# EasyEDA Pro project 毕设.eprj, schematic Schematic3
Board Name: 电源板毕设; Create Date: 2025-04-14; Page Name: P1; Project Name: 毕设; Schematic Name: Schematic3; Update Date: 2025-04-14; Company: 嘉立创EDA; Page Size: A4; Version: V1.0
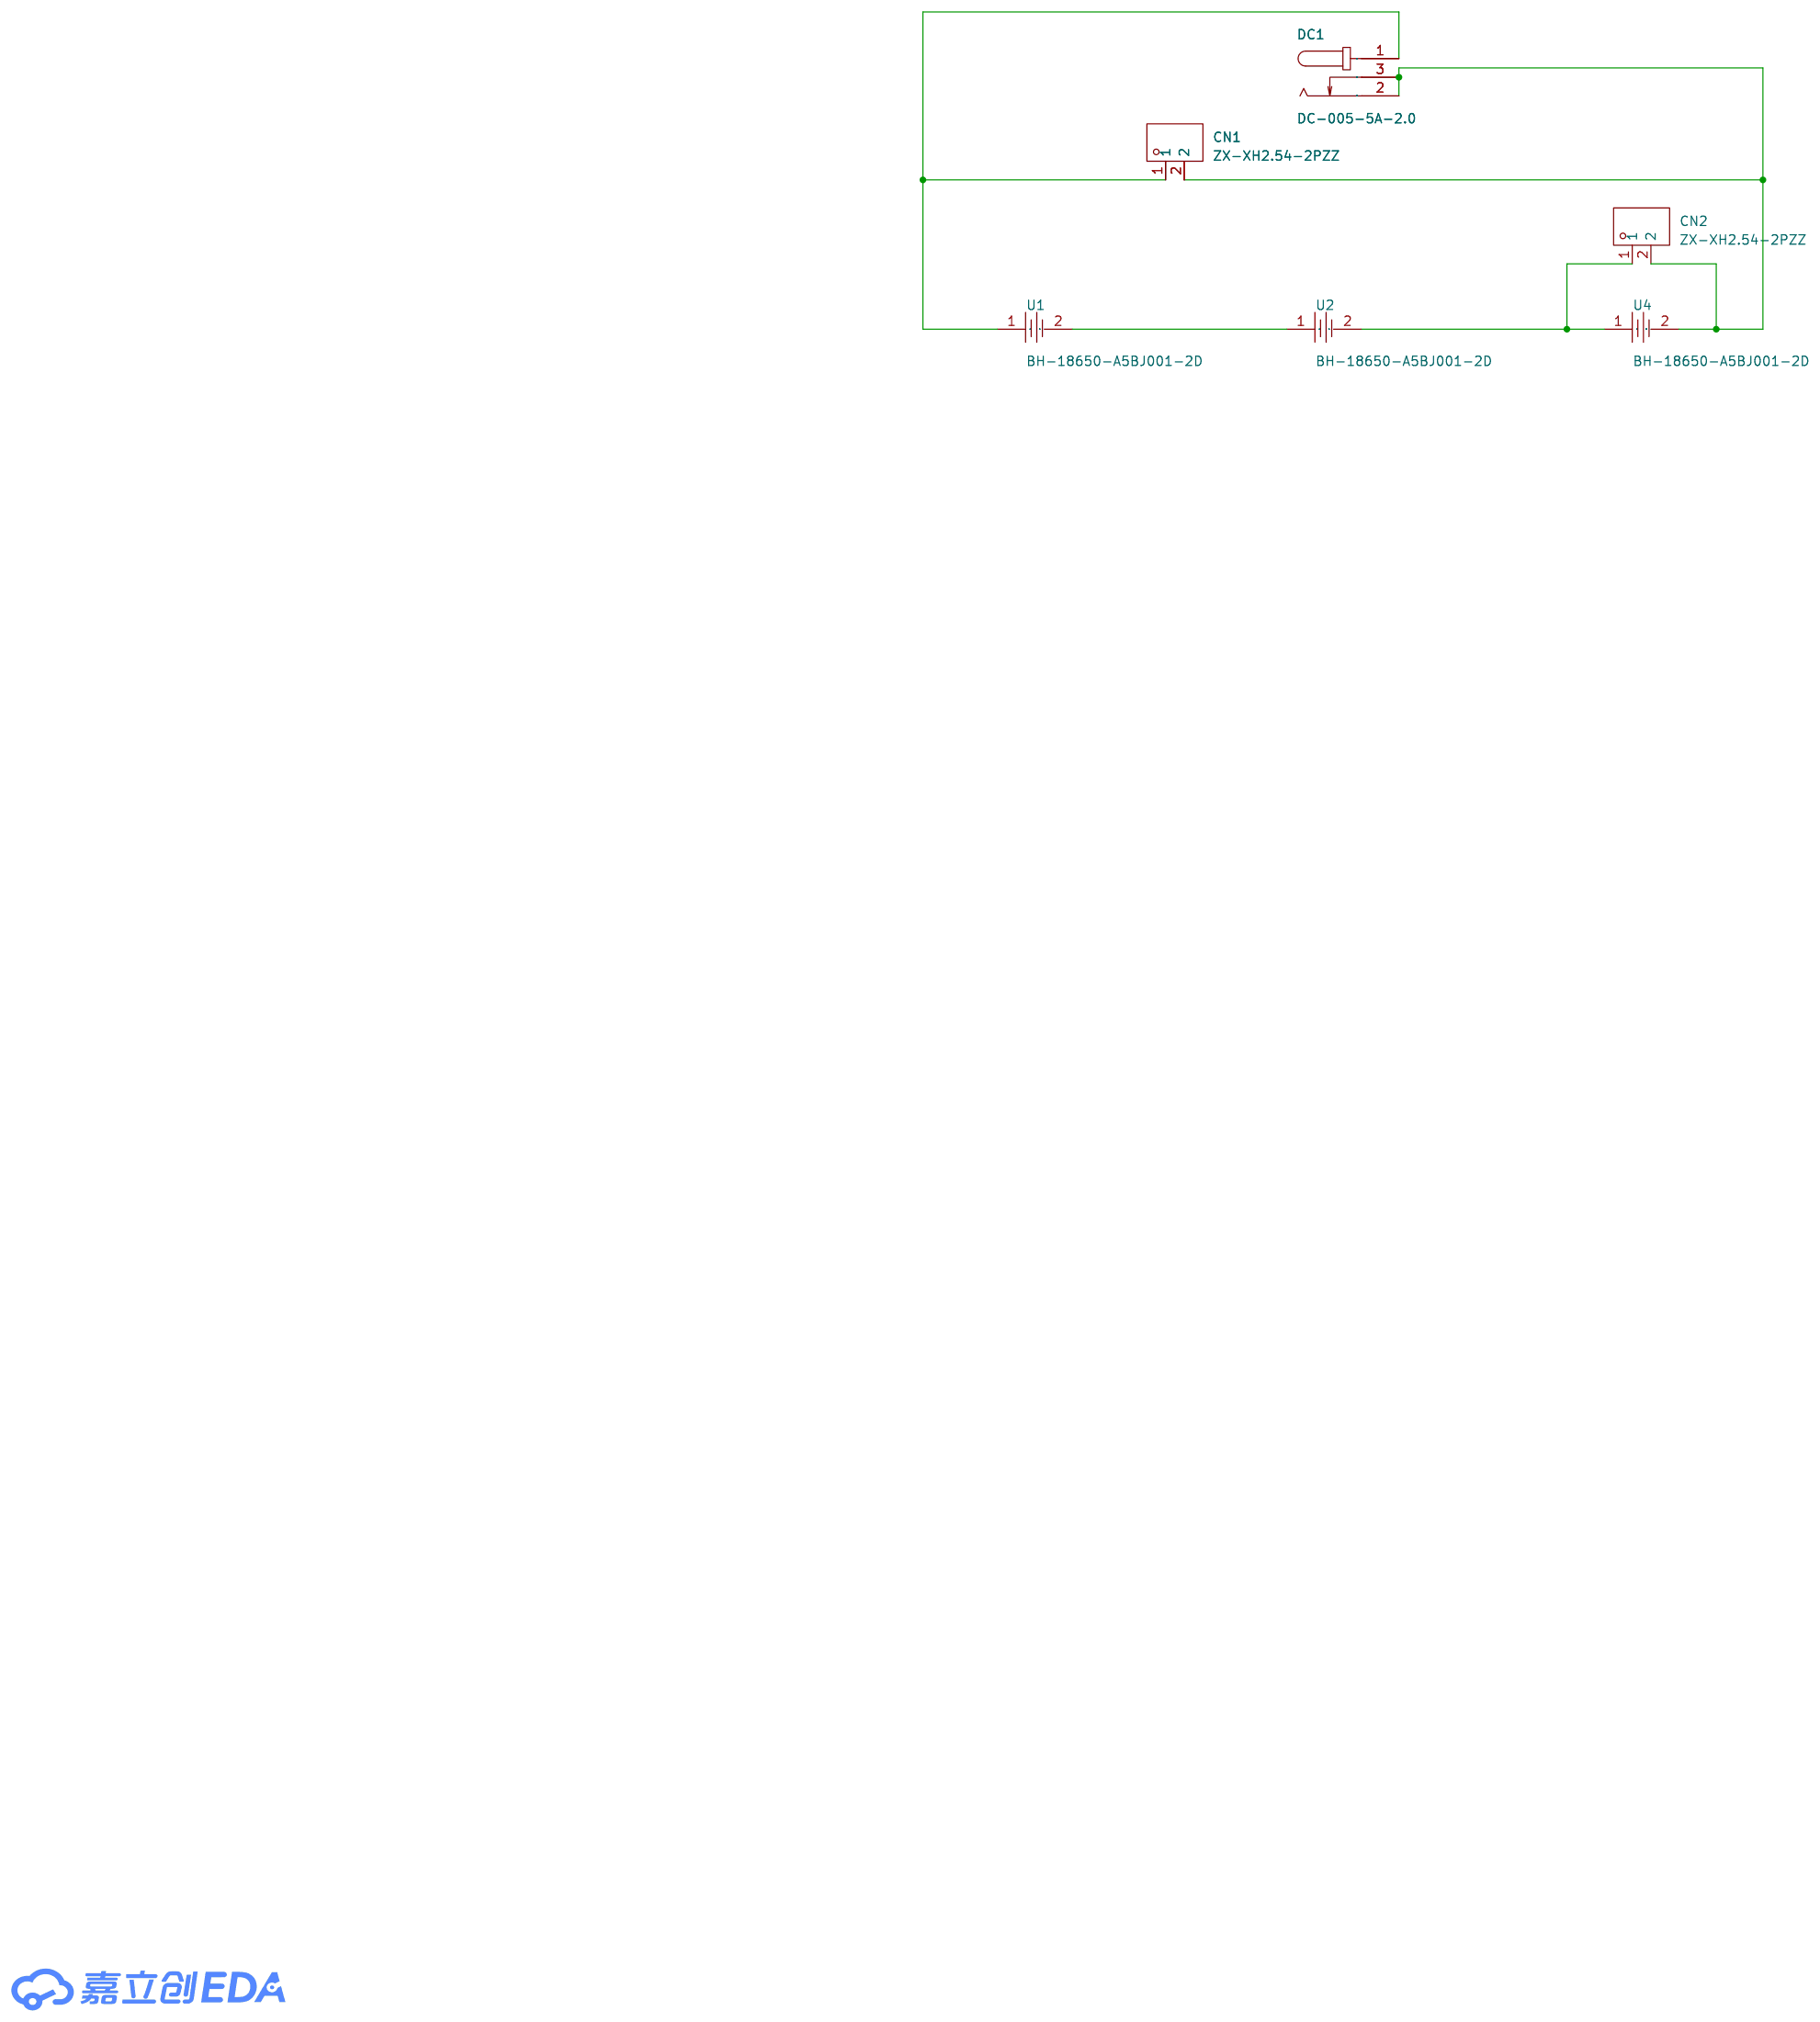
[diagram p2: schematic sheet]

## Parts
CN1  ZX-XH2.54-2PZZ  [CONN-TH_2P-P2.50_HX25003-2A]
CN2  ZX-XH2.54-2PZZ  [CONN-TH_2P-P2.50_HX25003-2A]
DC1  DC-005-5A-2.0  [DC-IN-TH_DC-005-5A-2.0]
U1  BH-18650-A5BJ001-2D  [BAT-TH_BH-18650-A5BJ001-2D]
U2  BH-18650-A5BJ001-2D  [BAT-TH_BH-18650-A5BJ001-2D]
U4  BH-18650-A5BJ001-2D  [BAT-TH_BH-18650-A5BJ001-2D]

## Library data of the parts
CN1 CN2 = ZX-XH2.54-2PZZ: LCSC Part Name: 1x2P 间距:2.5mm 直插 系列:XH; Supplier Part: C7429632; Manufacturer: Megastar(兆星); Supplier Footprint: 插件,P=2.5mm; JLCPCB Part Class: 扩展库; Datasheet: https://atta.szlcsc.com/upload/public/pdf/source/20230619/19BA6947230AA44A04D3EDD65E618FD0.pdf; Supplier: LCSC; Pins Structure: 1x2P; Pitch: 2.5mm; Mounting Type: 直插; Reference Series: XH; Number of Pins: 2P; Number of Rows: 1; Number of PINs Per Row: 2; Rated Current: 3A; Contact Material: 黄铜; Contact Plating: 锡; Operating Temperature: -25℃~+85℃; Rated Voltage (Max): 250V; Plastic Material: PA66; Flame Retardant Rating: UL94V-0; Color: 白色; Z-Height of the Board: 7mm; X-Length of Bottom Edge on Board (Spacing Line): 7.5mm; Y-Width of Bottom Edge on Board: 5.9mm
DC1 = DC-005-5A-2.0: LCSC Part Name: DC电源插座 内径:2mm 外径:6.2mm; Supplier Part: C381116; Manufacturer: XKB Connection(中国星坤); Supplier Footprint: 插件; JLCPCB Part Class: 扩展库; Datasheet: https://atta.szlcsc.com/upload/public/pdf/source/20211015/707A35F7AB6E89C57AAB641950105BB7.pdf; Supplier: LCSC; Connector Type: DC电源插座; Mounting Style: 弯插; Inside Contact Diameter: 2mm; Outside Contact Diameter: 6.2mm; Current Rating (Max): 5A; Voltage Rating (Max): 24V; Operating Temperature Range: -20℃~+70℃
U1 U2 U4 = BH-18650-A5BJ001-2D: LCSC Part Name: 电池盒; Supplier Part: C19184083; Manufacturer: MYOUNG(美阳); Supplier Footprint: 插件; JLCPCB Part Class: 扩展库; Datasheet: https://atta.szlcsc.com/upload/public/pdf/source/20231108/7CF586EC5DCFE5D582991176466319C5.pdf; Supplier: LCSC; Connector Type: 电池盒; Contact Plating: 镍; Operating Temperature Range: -10℃~+100℃

## Nets
$1N296: U1.2 U2.1
Net-(CN1-1): CN1.1 DC1.1 U1.1
Net-(CN1-2): CN1.2 CN2.2 DC1.2 DC1.3 U4.2
Net-(CN2-1): CN2.1 U2.2 U4.1
